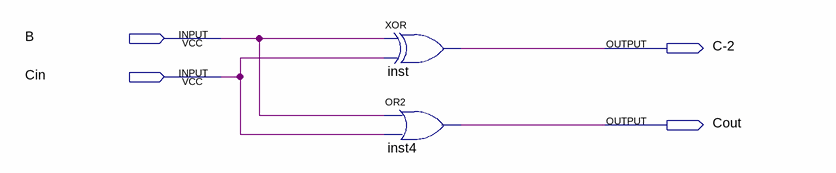
[diagram p0: schematic sheet]
// Quartus schematic Comp-2-1-bit.bdf as structural Verilog: 2 symbols, 4 pins
module \Comp-2-1-bit  (
  input  B,
  input  Cin,
  output \C-2 ,
  output Cout
);

  xor inst (\C-2 , B, Cin);
  or inst4 (Cout, B, Cin);
endmodule
